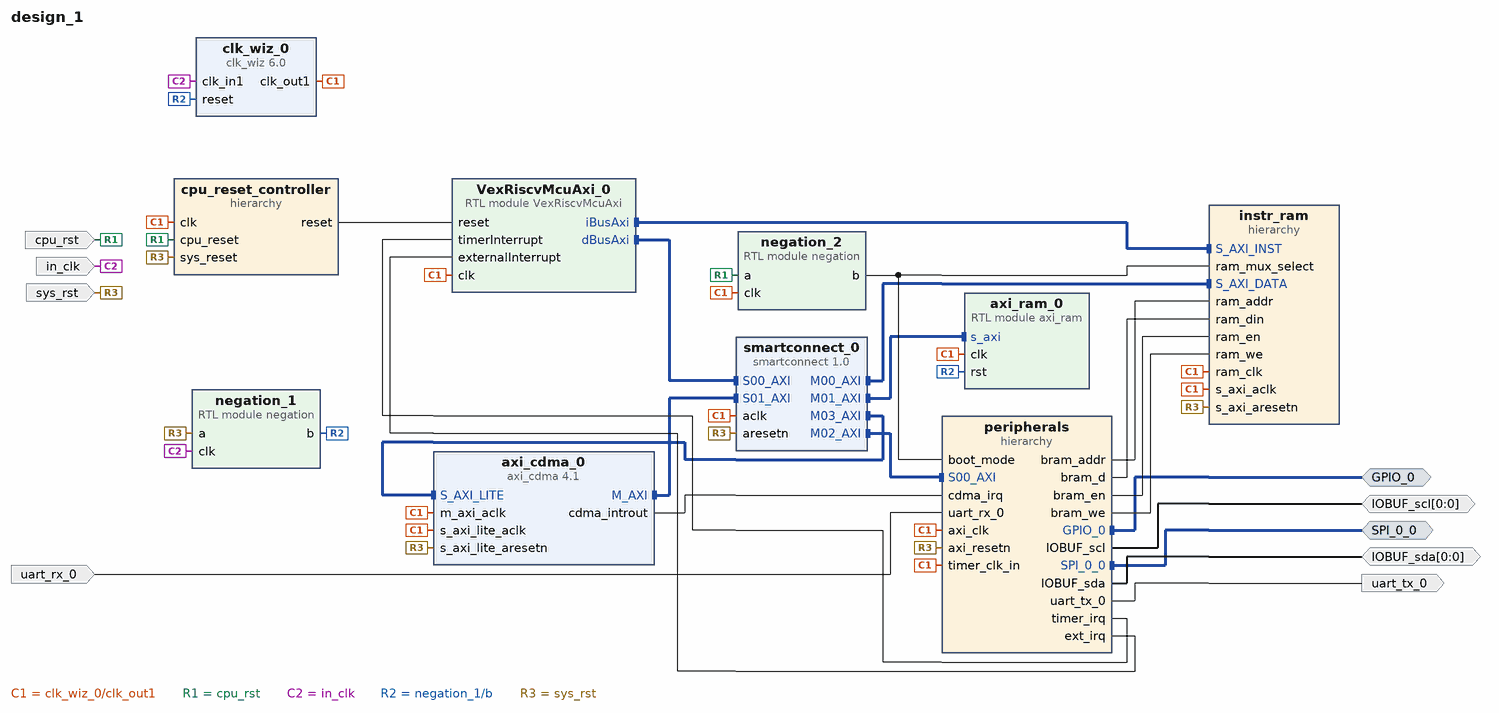
[diagram p0: block diagram of the top level]
# Vivado block design design_1, xc7s50csga324-1, Vivado 2025.2
create_bd_design design_1

create_bd_intf_port -mode Master -vlnv xilinx.com:interface:gpio_rtl:1.0 GPIO_0
create_bd_intf_port -mode Master -vlnv xilinx.com:interface:spi_rtl:1.0 SPI_0_0
create_bd_port -dir O uart_tx_0
create_bd_port -dir I uart_rx_0
create_bd_port -dir I cpu_rst
create_bd_port -dir I sys_rst
create_bd_port -dir I -type clk in_clk
set_property -dict {CONFIG.FREQ_HZ 100000000} [get_bd_ports in_clk]
create_bd_port -dir IO -from 0 -to 0 IOBUF_scl
create_bd_port -dir IO -from 0 -to 0 IOBUF_sda

create_bd_cell -type module -reference VexRiscvMcuAxi VexRiscvMcuAxi_0
create_bd_cell -type module -reference axi_ram axi_ram_0
create_bd_cell -type ip -vlnv xilinx.com:ip:axi_cdma:4.1 axi_cdma_0
set_property -dict {CONFIG.C_INCLUDE_SG 0} [get_bd_cells axi_cdma_0]
create_bd_cell -type ip -vlnv xilinx.com:ip:smartconnect:1.0 smartconnect_0
set_property -dict {CONFIG.NUM_MI 5} [get_bd_cells smartconnect_0]
create_bd_cell -type hier instr_ram
create_bd_cell -type hier peripherals
create_bd_cell -type hier cpu_reset_controller
create_bd_cell -type module -reference negation negation_1
create_bd_cell -type ip -vlnv xilinx.com:ip:clk_wiz:6.0 clk_wiz_0
create_bd_cell -type module -reference negation negation_2

# ---- hierarchy /instr_ram ----
current_bd_instance /instr_ram
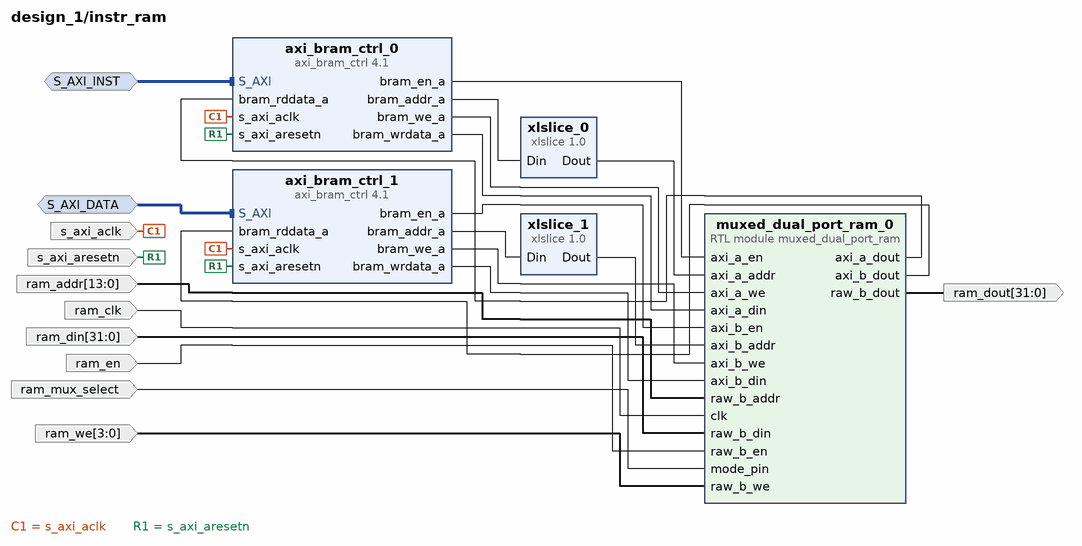
[diagram p1: block diagram inside /instr_ram]
create_bd_intf_pin -mode Slave -vlnv xilinx.com:interface:aximm_rtl:1.0 S_AXI_DATA
create_bd_intf_pin -mode Slave -vlnv xilinx.com:interface:aximm_rtl:1.0 S_AXI_INST
create_bd_pin -dir I s_axi_aclk
create_bd_pin -dir I s_axi_aresetn
create_bd_pin -dir I ram_mux_select
create_bd_pin -dir I ram_en
create_bd_pin -dir I -from 3 -to 0 ram_we
create_bd_pin -dir I -from 13 -to 0 ram_addr
create_bd_pin -dir I -from 31 -to 0 ram_din
create_bd_pin -dir O -from 31 -to 0 ram_dout
create_bd_pin -dir I ram_clk

create_bd_cell -type module -reference muxed_dual_port_ram muxed_dual_port_ram_0
set_property -dict {CONFIG.ADDR_WIDTH 12} [get_bd_cells muxed_dual_port_ram_0]
create_bd_cell -type ip -vlnv xilinx.com:ip:axi_bram_ctrl:4.1 axi_bram_ctrl_1
set_property -dict {CONFIG.SINGLE_PORT_BRAM 1} [get_bd_cells axi_bram_ctrl_1]
create_bd_cell -type ip -vlnv xilinx.com:ip:axi_bram_ctrl:4.1 axi_bram_ctrl_0
set_property -dict {CONFIG.SINGLE_PORT_BRAM 1} [get_bd_cells axi_bram_ctrl_0]
create_bd_cell -type ip -vlnv xilinx.com:ip:xlslice:1.0 xlslice_0
set_property -dict {CONFIG.DIN_FROM 13 CONFIG.DIN_TO 2 CONFIG.DIN_WIDTH 14} [get_bd_cells xlslice_0]
create_bd_cell -type ip -vlnv xilinx.com:ip:xlslice:1.0 xlslice_1
set_property -dict {CONFIG.DIN_FROM 13 CONFIG.DIN_TO 2 CONFIG.DIN_WIDTH 14} [get_bd_cells xlslice_1]

# ---- hierarchy /peripherals ----
current_bd_instance /peripherals
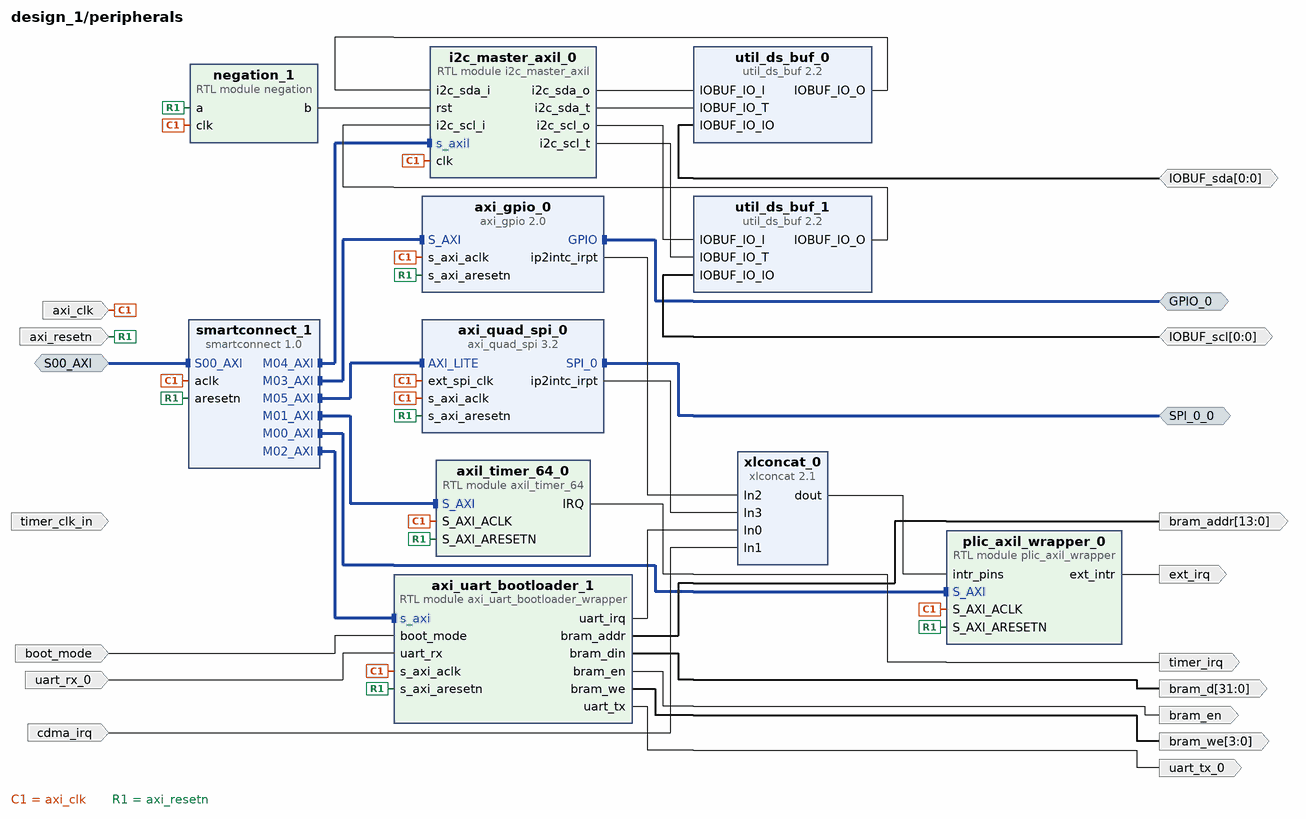
[diagram p2: block diagram inside /peripherals]
create_bd_intf_pin -mode Slave -vlnv xilinx.com:interface:aximm_rtl:1.0 S00_AXI
create_bd_intf_pin -mode Master -vlnv xilinx.com:interface:gpio_rtl:1.0 GPIO_0
create_bd_intf_pin -mode Master -vlnv xilinx.com:interface:spi_rtl:1.0 SPI_0_0
create_bd_pin -dir O -type intr ext_irq
create_bd_pin -dir O -type intr timer_irq
create_bd_pin -dir I axi_resetn
create_bd_pin -dir I axi_clk
create_bd_pin -dir I timer_clk_in
create_bd_pin -dir I boot_mode
create_bd_pin -dir I cdma_irq
create_bd_pin -dir O uart_tx_0
create_bd_pin -dir I uart_rx_0
create_bd_pin -dir O bram_en
create_bd_pin -dir O -from 3 -to 0 bram_we
create_bd_pin -dir O -from 13 -to 0 bram_addr
create_bd_pin -dir O -from 31 -to 0 bram_d
create_bd_pin -dir IO -from 0 -to 0 IOBUF_scl
create_bd_pin -dir IO -from 0 -to 0 IOBUF_sda

create_bd_cell -type ip -vlnv xilinx.com:ip:smartconnect:1.0 smartconnect_1
set_property -dict {CONFIG.NUM_MI 6 CONFIG.NUM_SI 1} [get_bd_cells smartconnect_1]
create_bd_cell -type module -reference plic_axil_wrapper plic_axil_wrapper_0
create_bd_cell -type module -reference axil_timer_64 axil_timer_64_0
create_bd_cell -type ip -vlnv xilinx.com:ip:xlconcat:2.1 xlconcat_0
set_property -dict {CONFIG.NUM_PORTS 8} [get_bd_cells xlconcat_0]
create_bd_cell -type ip -vlnv xilinx.com:ip:axi_gpio:2.0 axi_gpio_0
set_property -dict {CONFIG.C_ALL_INPUTS 0 CONFIG.C_GPIO_WIDTH 4 CONFIG.C_INTERRUPT_PRESENT 1} [get_bd_cells axi_gpio_0]
create_bd_cell -type module -reference i2c_master_axil i2c_master_axil_0
create_bd_cell -type module -reference negation negation_1
create_bd_cell -type module -reference axi_uart_bootloader_wrapper axi_uart_bootloader_1
create_bd_cell -type ip -vlnv xilinx.com:ip:axi_quad_spi:3.2 axi_quad_spi_0
set_property -dict {CONFIG.C_USE_STARTUP 0} [get_bd_cells axi_quad_spi_0]
create_bd_cell -type ip -vlnv xilinx.com:ip:util_ds_buf:2.2 util_ds_buf_0
set_property -dict {CONFIG.C_BUF_TYPE IOBUF} [get_bd_cells util_ds_buf_0]
create_bd_cell -type ip -vlnv xilinx.com:ip:util_ds_buf:2.2 util_ds_buf_1
set_property -dict {CONFIG.C_BUF_TYPE IOBUF} [get_bd_cells util_ds_buf_1]

# ---- hierarchy /cpu_reset_controller ----
current_bd_instance /cpu_reset_controller
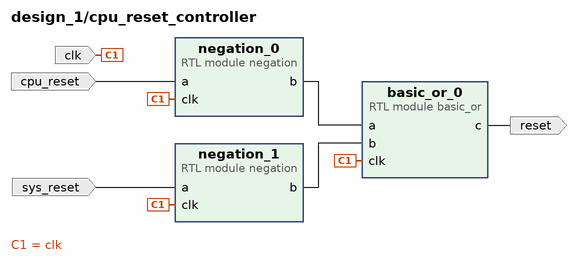
[diagram p3: block diagram inside /cpu_reset_controller]
create_bd_pin -dir O reset
create_bd_pin -dir I clk
create_bd_pin -dir I cpu_reset
create_bd_pin -dir I sys_reset

create_bd_cell -type module -reference negation negation_0
create_bd_cell -type module -reference negation negation_1
create_bd_cell -type module -reference basic_or basic_or_0

# ---- connections ----

current_bd_instance /instr_ram
connect_bd_intf_net [get_bd_intf_pins axi_bram_ctrl_1/S_AXI] [get_bd_intf_pins S_AXI_DATA]
connect_bd_intf_net [get_bd_intf_pins axi_bram_ctrl_0/S_AXI] [get_bd_intf_pins S_AXI_INST]
connect_bd_net [get_bd_pins axi_bram_ctrl_0/bram_addr_a] [get_bd_pins xlslice_0/Din]
connect_bd_net [get_bd_pins axi_bram_ctrl_0/bram_en_a] [get_bd_pins muxed_dual_port_ram_0/axi_a_en]
connect_bd_net [get_bd_pins axi_bram_ctrl_0/bram_we_a] [get_bd_pins muxed_dual_port_ram_0/axi_a_we]
connect_bd_net [get_bd_pins axi_bram_ctrl_0/bram_wrdata_a] [get_bd_pins muxed_dual_port_ram_0/axi_a_din]
connect_bd_net [get_bd_pins axi_bram_ctrl_1/bram_addr_a] [get_bd_pins xlslice_1/Din]
connect_bd_net [get_bd_pins axi_bram_ctrl_1/bram_en_a] [get_bd_pins muxed_dual_port_ram_0/axi_b_en]
connect_bd_net [get_bd_pins axi_bram_ctrl_1/bram_we_a] [get_bd_pins muxed_dual_port_ram_0/axi_b_we]
connect_bd_net [get_bd_pins axi_bram_ctrl_1/bram_wrdata_a] [get_bd_pins muxed_dual_port_ram_0/axi_b_din]
connect_bd_net [get_bd_pins muxed_dual_port_ram_0/axi_a_dout] [get_bd_pins axi_bram_ctrl_0/bram_rddata_a]
connect_bd_net [get_bd_pins muxed_dual_port_ram_0/axi_b_dout] [get_bd_pins axi_bram_ctrl_1/bram_rddata_a]
connect_bd_net [get_bd_pins muxed_dual_port_ram_0/raw_b_dout] [get_bd_pins ram_dout]
connect_bd_net [get_bd_pins ram_addr] [get_bd_pins muxed_dual_port_ram_0/raw_b_addr]
connect_bd_net [get_bd_pins ram_clk] [get_bd_pins muxed_dual_port_ram_0/clk]
connect_bd_net [get_bd_pins ram_din] [get_bd_pins muxed_dual_port_ram_0/raw_b_din]
connect_bd_net [get_bd_pins ram_en] [get_bd_pins muxed_dual_port_ram_0/raw_b_en]
connect_bd_net [get_bd_pins ram_mux_select] [get_bd_pins muxed_dual_port_ram_0/mode_pin]
connect_bd_net [get_bd_pins ram_we] [get_bd_pins muxed_dual_port_ram_0/raw_b_we]
connect_bd_net [get_bd_pins s_axi_aclk] [get_bd_pins axi_bram_ctrl_0/s_axi_aclk] [get_bd_pins axi_bram_ctrl_1/s_axi_aclk]
connect_bd_net [get_bd_pins s_axi_aresetn] [get_bd_pins axi_bram_ctrl_0/s_axi_aresetn] [get_bd_pins axi_bram_ctrl_1/s_axi_aresetn]
connect_bd_net [get_bd_pins xlslice_0/Dout] [get_bd_pins muxed_dual_port_ram_0/axi_a_addr]
connect_bd_net [get_bd_pins xlslice_1/Dout] [get_bd_pins muxed_dual_port_ram_0/axi_b_addr]

current_bd_instance /peripherals
connect_bd_intf_net [get_bd_intf_pins axi_gpio_0/GPIO] [get_bd_intf_pins GPIO_0]
connect_bd_intf_net [get_bd_intf_pins axi_quad_spi_0/SPI_0] [get_bd_intf_pins SPI_0_0]
connect_bd_intf_net [get_bd_intf_pins smartconnect_1/S00_AXI] [get_bd_intf_pins S00_AXI]
connect_bd_intf_net [get_bd_intf_pins smartconnect_1/M00_AXI] [get_bd_intf_pins plic_axil_wrapper_0/S_AXI]
connect_bd_intf_net [get_bd_intf_pins smartconnect_1/M01_AXI] [get_bd_intf_pins axil_timer_64_0/S_AXI]
connect_bd_intf_net [get_bd_intf_pins axi_uart_bootloader_1/s_axi] [get_bd_intf_pins smartconnect_1/M02_AXI]
connect_bd_intf_net [get_bd_intf_pins axi_gpio_0/S_AXI] [get_bd_intf_pins smartconnect_1/M03_AXI]
connect_bd_intf_net [get_bd_intf_pins smartconnect_1/M04_AXI] [get_bd_intf_pins i2c_master_axil_0/s_axil]
connect_bd_intf_net [get_bd_intf_pins axi_quad_spi_0/AXI_LITE] [get_bd_intf_pins smartconnect_1/M05_AXI]
connect_bd_net [get_bd_pins IOBUF_scl] [get_bd_pins util_ds_buf_1/IOBUF_IO_IO]
connect_bd_net [get_bd_pins IOBUF_sda] [get_bd_pins util_ds_buf_0/IOBUF_IO_IO]
connect_bd_net -net axi_clk1_1 [get_bd_pins cdma_irq] [get_bd_pins xlconcat_0/In1]
connect_bd_net [get_bd_pins axi_clk] \
  [get_bd_pins axi_gpio_0/s_axi_aclk] [get_bd_pins i2c_master_axil_0/clk] [get_bd_pins negation_1/clk] \
  [get_bd_pins smartconnect_1/aclk] [get_bd_pins axi_uart_bootloader_1/s_axi_aclk] [get_bd_pins axi_quad_spi_0/s_axi_aclk] \
  [get_bd_pins axi_quad_spi_0/ext_spi_clk] [get_bd_pins axil_timer_64_0/S_AXI_ACLK] \
  [get_bd_pins plic_axil_wrapper_0/S_AXI_ACLK]
connect_bd_net [get_bd_pins axi_gpio_0/ip2intc_irpt] [get_bd_pins xlconcat_0/In2]
connect_bd_net [get_bd_pins axi_quad_spi_0/ip2intc_irpt] [get_bd_pins xlconcat_0/In3]
connect_bd_net [get_bd_pins axi_resetn] \
  [get_bd_pins negation_1/a] [get_bd_pins axi_gpio_0/s_axi_aresetn] [get_bd_pins smartconnect_1/aresetn] \
  [get_bd_pins axi_uart_bootloader_1/s_axi_aresetn] [get_bd_pins axi_quad_spi_0/s_axi_aresetn] \
  [get_bd_pins axil_timer_64_0/S_AXI_ARESETN] [get_bd_pins plic_axil_wrapper_0/S_AXI_ARESETN]
connect_bd_net [get_bd_pins axi_uart_bootloader_1/bram_addr] [get_bd_pins bram_addr]
connect_bd_net [get_bd_pins axi_uart_bootloader_1/bram_din] [get_bd_pins bram_d]
connect_bd_net [get_bd_pins axi_uart_bootloader_1/bram_en] [get_bd_pins bram_en]
connect_bd_net [get_bd_pins axi_uart_bootloader_1/bram_we] [get_bd_pins bram_we]
connect_bd_net [get_bd_pins axi_uart_bootloader_1/uart_irq] [get_bd_pins xlconcat_0/In0]
connect_bd_net [get_bd_pins axi_uart_bootloader_1/uart_tx] [get_bd_pins uart_tx_0]
connect_bd_net [get_bd_pins axil_timer_64_0/IRQ] [get_bd_pins timer_irq]
connect_bd_net [get_bd_pins boot_mode] [get_bd_pins axi_uart_bootloader_1/boot_mode]
connect_bd_net [get_bd_pins i2c_master_axil_0/i2c_scl_o] [get_bd_pins util_ds_buf_1/IOBUF_IO_I]
connect_bd_net [get_bd_pins i2c_master_axil_0/i2c_scl_t] [get_bd_pins util_ds_buf_1/IOBUF_IO_T]
connect_bd_net [get_bd_pins i2c_master_axil_0/i2c_sda_o] [get_bd_pins util_ds_buf_0/IOBUF_IO_I]
connect_bd_net [get_bd_pins i2c_master_axil_0/i2c_sda_t] [get_bd_pins util_ds_buf_0/IOBUF_IO_T]
connect_bd_net [get_bd_pins negation_1/b] [get_bd_pins i2c_master_axil_0/rst]
connect_bd_net [get_bd_pins plic_axil_wrapper_0/ext_intr] [get_bd_pins ext_irq]
# net timer_clk_in_1 has one end: timer_clk_in
connect_bd_net -net uart_rx_0_1 [get_bd_pins uart_rx_0] [get_bd_pins axi_uart_bootloader_1/uart_rx]
connect_bd_net [get_bd_pins util_ds_buf_0/IOBUF_IO_O] [get_bd_pins i2c_master_axil_0/i2c_sda_i]
connect_bd_net [get_bd_pins util_ds_buf_1/IOBUF_IO_O] [get_bd_pins i2c_master_axil_0/i2c_scl_i]
connect_bd_net [get_bd_pins xlconcat_0/dout] [get_bd_pins plic_axil_wrapper_0/intr_pins]

current_bd_instance /cpu_reset_controller
connect_bd_net [get_bd_pins basic_or_0/c] [get_bd_pins reset]
connect_bd_net [get_bd_pins clk] [get_bd_pins negation_0/clk] [get_bd_pins negation_1/clk] [get_bd_pins basic_or_0/clk]
connect_bd_net [get_bd_pins cpu_reset] [get_bd_pins negation_0/a]
connect_bd_net [get_bd_pins negation_0/b] [get_bd_pins basic_or_0/a]
connect_bd_net [get_bd_pins negation_1/b] [get_bd_pins basic_or_0/b]
connect_bd_net [get_bd_pins sys_reset] [get_bd_pins negation_1/a]

current_bd_instance /
connect_bd_intf_net [get_bd_intf_pins instr_ram/S_AXI_DATA] [get_bd_intf_pins smartconnect_0/M00_AXI]
connect_bd_intf_net [get_bd_intf_pins instr_ram/S_AXI_INST] [get_bd_intf_pins VexRiscvMcuAxi_0/iBusAxi]
connect_bd_intf_net [get_bd_intf_pins VexRiscvMcuAxi_0/dBusAxi] [get_bd_intf_pins smartconnect_0/S00_AXI]
connect_bd_intf_net [get_bd_intf_pins axi_cdma_0/M_AXI] [get_bd_intf_pins smartconnect_0/S01_AXI]
connect_bd_intf_net [get_bd_intf_ports GPIO_0] [get_bd_intf_pins peripherals/GPIO_0]
connect_bd_intf_net [get_bd_intf_ports SPI_0_0] [get_bd_intf_pins peripherals/SPI_0_0]
connect_bd_intf_net [get_bd_intf_pins smartconnect_0/M01_AXI] [get_bd_intf_pins axi_ram_0/s_axi]
connect_bd_intf_net [get_bd_intf_pins smartconnect_0/M02_AXI] [get_bd_intf_pins peripherals/S00_AXI]
connect_bd_intf_net [get_bd_intf_pins smartconnect_0/M03_AXI] [get_bd_intf_pins axi_cdma_0/S_AXI_LITE]
connect_bd_net [get_bd_ports IOBUF_scl] [get_bd_pins peripherals/IOBUF_scl]
connect_bd_net [get_bd_ports IOBUF_sda] [get_bd_pins peripherals/IOBUF_sda]
connect_bd_net -net cdma_irq_1 [get_bd_pins axi_cdma_0/cdma_introut] [get_bd_pins peripherals/cdma_irq]
connect_bd_net [get_bd_pins clk_wiz_0/clk_out1] \
  [get_bd_pins smartconnect_0/aclk] [get_bd_pins axi_cdma_0/m_axi_aclk] [get_bd_pins instr_ram/s_axi_aclk] \
  [get_bd_pins peripherals/axi_clk] [get_bd_pins cpu_reset_controller/clk] [get_bd_pins axi_cdma_0/s_axi_lite_aclk] \
  [get_bd_pins peripherals/timer_clk_in] [get_bd_pins instr_ram/ram_clk] [get_bd_pins axi_ram_0/clk] \
  [get_bd_pins negation_2/clk] [get_bd_pins VexRiscvMcuAxi_0/clk]
connect_bd_net -net cpu_reset_controller_c [get_bd_pins cpu_reset_controller/reset] [get_bd_pins VexRiscvMcuAxi_0/reset]
connect_bd_net [get_bd_ports cpu_rst] [get_bd_pins cpu_reset_controller/cpu_reset] [get_bd_pins negation_2/a]
connect_bd_net [get_bd_ports in_clk] [get_bd_pins clk_wiz_0/clk_in1] [get_bd_pins negation_1/clk]
connect_bd_net [get_bd_pins negation_1/b] [get_bd_pins axi_ram_0/rst] [get_bd_pins clk_wiz_0/reset]
connect_bd_net [get_bd_pins negation_2/b] [get_bd_pins peripherals/boot_mode] [get_bd_pins instr_ram/ram_mux_select]
connect_bd_net -net peripherals_IRQ [get_bd_pins peripherals/timer_irq] [get_bd_pins VexRiscvMcuAxi_0/timerInterrupt]
connect_bd_net [get_bd_pins peripherals/bram_addr] [get_bd_pins instr_ram/ram_addr]
connect_bd_net [get_bd_pins peripherals/bram_d] [get_bd_pins instr_ram/ram_din]
connect_bd_net [get_bd_pins peripherals/bram_en] [get_bd_pins instr_ram/ram_en]
connect_bd_net [get_bd_pins peripherals/bram_we] [get_bd_pins instr_ram/ram_we]
connect_bd_net -net peripherals_ext_intr [get_bd_pins peripherals/ext_irq] [get_bd_pins VexRiscvMcuAxi_0/externalInterrupt]
connect_bd_net [get_bd_pins peripherals/uart_tx_0] [get_bd_ports uart_tx_0]
connect_bd_net -net sys_rst_n_1 [get_bd_ports sys_rst] \
  [get_bd_pins negation_1/a] [get_bd_pins axi_cdma_0/s_axi_lite_aresetn] [get_bd_pins peripherals/axi_resetn] \
  [get_bd_pins instr_ram/s_axi_aresetn] [get_bd_pins smartconnect_0/aresetn] [get_bd_pins cpu_reset_controller/sys_reset]
connect_bd_net -net uart_rx_0_1 [get_bd_ports uart_rx_0] [get_bd_pins peripherals/uart_rx_0]

# ---- address map ----
assign_bd_address -offset 0x00000000 -range 16K -target_address_space [get_bd_addr_spaces axi_cdma_0/Data] [get_bd_addr_segs instr_ram/axi_bram_ctrl_1/S_AXI/Mem0]
assign_bd_address -offset 0x10000000 -range 64K -target_address_space [get_bd_addr_spaces axi_cdma_0/Data] [get_bd_addr_segs axi_ram_0/s_axi/reg0]
assign_bd_address -offset 0x20000000 -range 4K -target_address_space [get_bd_addr_spaces axi_cdma_0/Data] [get_bd_addr_segs peripherals/plic_axil_wrapper_0/S_AXI/reg0]
assign_bd_address -offset 0x20001000 -range 4K -target_address_space [get_bd_addr_spaces axi_cdma_0/Data] [get_bd_addr_segs peripherals/axil_timer_64_0/S_AXI/reg0]
assign_bd_address -offset 0x20002000 -range 4K -target_address_space [get_bd_addr_spaces axi_cdma_0/Data] [get_bd_addr_segs peripherals/axi_uart_bootloader_1/s_axi/reg0]
assign_bd_address -offset 0x20003000 -range 4K -target_address_space [get_bd_addr_spaces axi_cdma_0/Data] [get_bd_addr_segs peripherals/axi_gpio_0/S_AXI/Reg]
assign_bd_address -offset 0x20004000 -range 4K -target_address_space [get_bd_addr_spaces axi_cdma_0/Data] [get_bd_addr_segs peripherals/i2c_master_axil_0/s_axil/reg0]
assign_bd_address -offset 0x20005000 -range 4K -target_address_space [get_bd_addr_spaces axi_cdma_0/Data] [get_bd_addr_segs peripherals/axi_quad_spi_0/AXI_LITE/Reg]
assign_bd_address -offset 0x30000000 -range 64K -target_address_space [get_bd_addr_spaces axi_cdma_0/Data] [get_bd_addr_segs axi_cdma_0/S_AXI_LITE/Reg]
assign_bd_address -offset 0x00000000 -range 16K -target_address_space [get_bd_addr_spaces VexRiscvMcuAxi_0/dBusAxi] [get_bd_addr_segs instr_ram/axi_bram_ctrl_1/S_AXI/Mem0]
assign_bd_address -offset 0x10000000 -range 64K -target_address_space [get_bd_addr_spaces VexRiscvMcuAxi_0/dBusAxi] [get_bd_addr_segs axi_ram_0/s_axi/reg0]
assign_bd_address -offset 0x20000000 -range 4K -target_address_space [get_bd_addr_spaces VexRiscvMcuAxi_0/dBusAxi] [get_bd_addr_segs peripherals/plic_axil_wrapper_0/S_AXI/reg0]
assign_bd_address -offset 0x20001000 -range 4K -target_address_space [get_bd_addr_spaces VexRiscvMcuAxi_0/dBusAxi] [get_bd_addr_segs peripherals/axil_timer_64_0/S_AXI/reg0]
assign_bd_address -offset 0x20002000 -range 4K -target_address_space [get_bd_addr_spaces VexRiscvMcuAxi_0/dBusAxi] [get_bd_addr_segs peripherals/axi_uart_bootloader_1/s_axi/reg0]
assign_bd_address -offset 0x20003000 -range 4K -target_address_space [get_bd_addr_spaces VexRiscvMcuAxi_0/dBusAxi] [get_bd_addr_segs peripherals/axi_gpio_0/S_AXI/Reg]
assign_bd_address -offset 0x20004000 -range 4K -target_address_space [get_bd_addr_spaces VexRiscvMcuAxi_0/dBusAxi] [get_bd_addr_segs peripherals/i2c_master_axil_0/s_axil/reg0]
assign_bd_address -offset 0x20005000 -range 4K -target_address_space [get_bd_addr_spaces VexRiscvMcuAxi_0/dBusAxi] [get_bd_addr_segs peripherals/axi_quad_spi_0/AXI_LITE/Reg]
assign_bd_address -offset 0x30000000 -range 64K -target_address_space [get_bd_addr_spaces VexRiscvMcuAxi_0/dBusAxi] [get_bd_addr_segs axi_cdma_0/S_AXI_LITE/Reg]
assign_bd_address -offset 0x00000000 -range 16K -target_address_space [get_bd_addr_spaces VexRiscvMcuAxi_0/iBusAxi] [get_bd_addr_segs instr_ram/axi_bram_ctrl_0/S_AXI/Mem0]

validate_bd_design
save_bd_design
